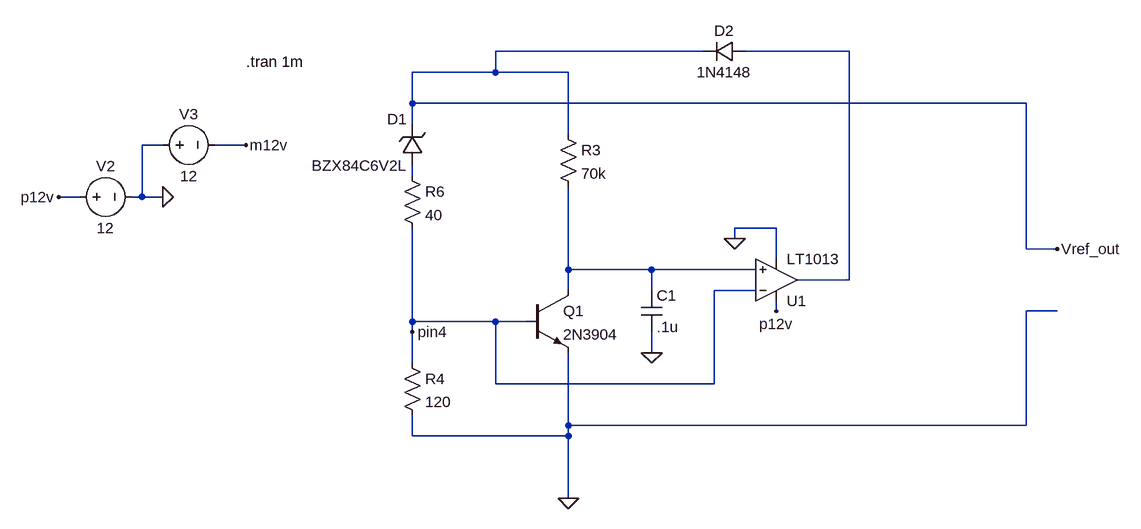
[diagram p0: schematic LTZ1000_zener_bias_loop.asc]
LTZ1000_zener_bias_loop.asc, the LTspice schematic file:
Version 4
SHEET 1 3232 872
WIRE 1072 -304 752 -304
WIRE 1296 -304 1136 -304
WIRE 752 -272 752 -304
WIRE 752 -272 624 -272
WIRE 864 -272 752 -272
WIRE 624 -224 624 -272
WIRE 1568 -224 624 -224
WIRE 624 -192 624 -224
WIRE 864 -176 864 -272
WIRE 240 -160 208 -160
WIRE 368 -160 320 -160
WIRE 624 -112 624 -128
WIRE 112 -80 80 -80
WIRE 208 -80 208 -160
WIRE 208 -80 192 -80
WIRE 240 -80 208 -80
WIRE 1184 -32 1120 -32
WIRE 1120 -16 1120 -32
WIRE 1568 0 1568 -224
WIRE 1616 0 1568 0
WIRE 1184 16 1184 -32
WIRE 864 32 864 -96
WIRE 992 32 864 32
WIRE 1152 32 992 32
WIRE 1296 48 1296 -304
WIRE 1296 48 1216 48
WIRE 864 64 864 32
WIRE 992 64 992 32
WIRE 1152 64 1088 64
WIRE 1184 96 1184 80
WIRE 1616 96 1568 96
WIRE 624 112 624 -32
WIRE 752 112 624 112
WIRE 800 112 752 112
WIRE 624 128 624 112
WIRE 992 160 992 128
WIRE 624 176 624 128
WIRE 752 208 752 112
WIRE 1088 208 1088 64
WIRE 1088 208 752 208
WIRE 864 272 864 160
WIRE 1568 272 1568 96
WIRE 1568 272 864 272
WIRE 624 288 624 256
WIRE 864 288 864 272
WIRE 864 288 624 288
WIRE 864 384 864 288
FLAG 240 -80 0
FLAG 80 -80 p12v
FLAG 368 -160 m12v
FLAG 1184 96 p12v
FLAG 992 160 0
FLAG 864 384 0
FLAG 1120 -16 0
FLAG 1616 0 Vref_out
FLAG 624 128 pin4
SYMBOL voltage 224 -160 R270
WINDOW 0 32 56 VTop 2
WINDOW 3 -32 56 VBottom 2
SYMATTR InstName V3
SYMATTR Value 12
SYMBOL voltage 96 -80 R270
WINDOW 0 32 56 VTop 2
WINDOW 3 -32 56 VBottom 2
SYMATTR InstName V2
SYMATTR Value 12
SYMBOL zener 640 -128 R180
WINDOW 0 24 72 Left 2
WINDOW 3 24 0 Left 2
SYMATTR InstName D1
SYMATTR Value BZX84C6V2L
SYMATTR Description Diode
SYMATTR Type diode
SYMBOL npn 800 64 R0
SYMATTR InstName Q1
SYMATTR Value 2N3904
SYMBOL res 848 -192 R0
SYMATTR InstName R3
SYMATTR Value 70k
SYMBOL res 608 160 R0
SYMATTR InstName R4
SYMATTR Value 120
SYMBOL res 608 -128 R0
SYMATTR InstName R6
SYMATTR Value 40
SYMBOL opamps\\LT1013 1184 112 M180
SYMATTR InstName U1
SYMBOL cap 976 64 R0
SYMATTR InstName C1
SYMATTR Value .1u
SYMBOL diode 1136 -320 R90
WINDOW 0 0 32 VBottom 2
WINDOW 3 32 32 VTop 2
SYMATTR InstName D2
SYMATTR Value 1N4148
TEXT 368 -288 Left 2 !.tran 1m

The netlist it stands for:
* LTZ1000_zener_bias_loop.asc
V3 0 m12v 12
V2 p12v 0 12
D1 N002 Vref_out BZX84C6V2L
Q1 N003 pin4 0 0 2N3904
R3 Vref_out N003 70k
R4 pin4 0 120
R6 N002 pin4 40
XU1 N003 pin4 p12v 0 N001 LT1013  ; pins In+ In- V+ V- OUT
C1 N003 0 .1u
D2 N001 Vref_out 1N4148
.model D D
.lib standard.dio
.model NPN NPN
.model PNP PNP
.lib standard.bjt
.tran 1m
.lib LTC.lib
.backanno
.end